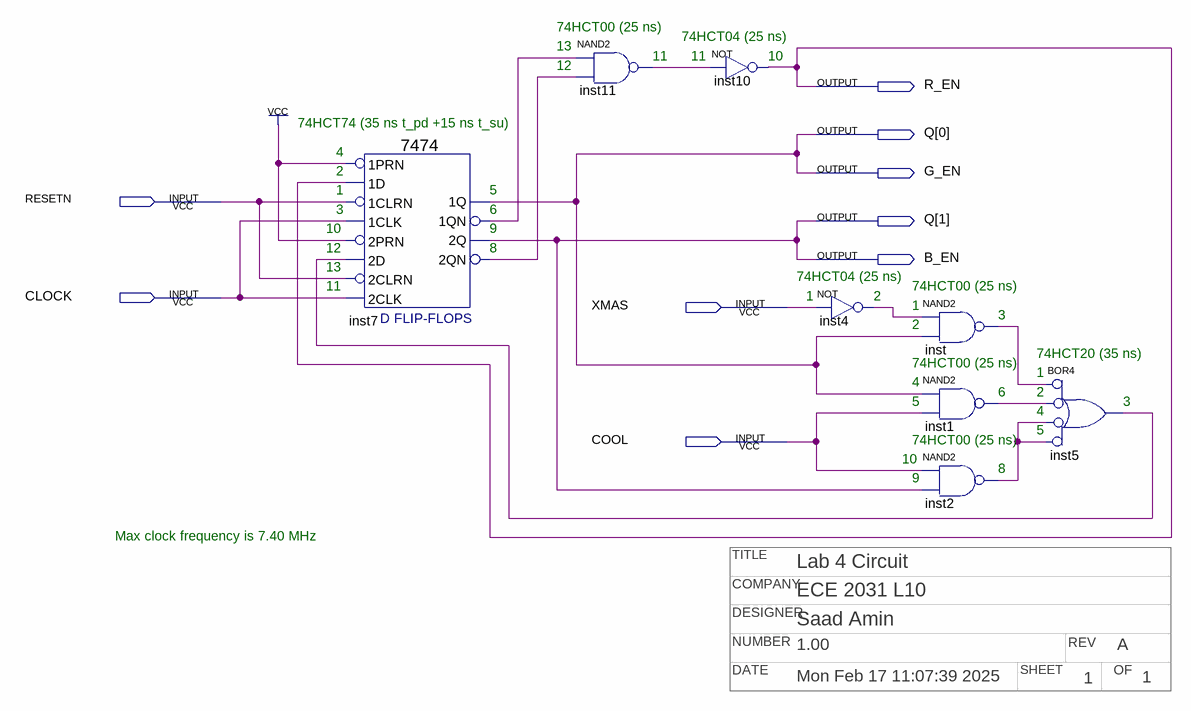
[diagram p0: schematic sheet]
// Quartus schematic CircuitPlan.bdf as structural Verilog: 8 symbols, 9 pins
// Title block: COMPANY: ECE 2031 L10; DATE: Mon Feb 17 11:07:39 2025; DESIGNER: Saad Amin; NUMBER: 1.00; OF: 1; REV: A; SHEET: 1; TITLE: Lab 4 Circuit
module CircuitPlan (
  input  RESETN,
  input  CLOCK,
  input  XMAS,
  input  COOL,
  output R_EN,
  output [1:0] Q,
  output G_EN,
  output B_EN
);

  wire inst1_out, inst2_out, inst4_out, inst5_out, inst7_1qn, inst7_2qn, inst11_out, inst_out;

  \7474  inst7 (
    .\2D (inst5_out), .\2PRN (1'b1), .\1CLK (CLOCK), .\1D (R_EN), .\1PRN (1'b1), .\2CLK (CLOCK),
    .\2CLRN (RESETN), .\1CLRN (RESETN), .\1QN (inst7_1qn), .\2Q (B_EN), .\2QN (inst7_2qn), .\1Q (G_EN));
  nand inst11 (inst11_out, inst7_1qn, inst7_2qn);
  not inst10 (R_EN, inst11_out);
  not inst4 (inst4_out, XMAS);
  nand inst (inst_out, inst4_out, G_EN);
  nand inst1 (inst1_out, G_EN, COOL);
  nand inst2 (inst2_out, COOL, B_EN);
  or inst5 (inst5_out, ~inst_out, ~inst1_out, ~inst2_out, ~inst2_out);  // BOR4

  assign Q = {B_EN, G_EN};

  // Notes on the sheet:
  //   74HCT00 (25 ns)
  //   74HCT04 (25 ns)
  //   13
  //   11
  //   11
  //   10
  //   12
  //   74HCT74 (35 ns t_pd +15 ns t_su)
  //   4
  //   2
  //   1
  //   5
  //   3
  //   6
  //   10
  //   9
  //   12
  //   8
  //   13
  //   74HCT04 (25 ns)
  //   11
  //   74HCT00 (25 ns)
  //   1
  //   2
  //   1
  //   3
  //   2
  //   74HCT20 (35 ns)
  //   74HCT00 (25 ns)
  //   1
  //   4
  //   6
  //   2
  //   5
  //   3
  //   4
  //   5
  //   74HCT00 (25 ns)
  //   10
  //   8
  //   9
  //   Max clock frequency is 7.40 MHz
endmodule
